# EAGLE design TMC2208 OTP (EAGLE 8.6.0)
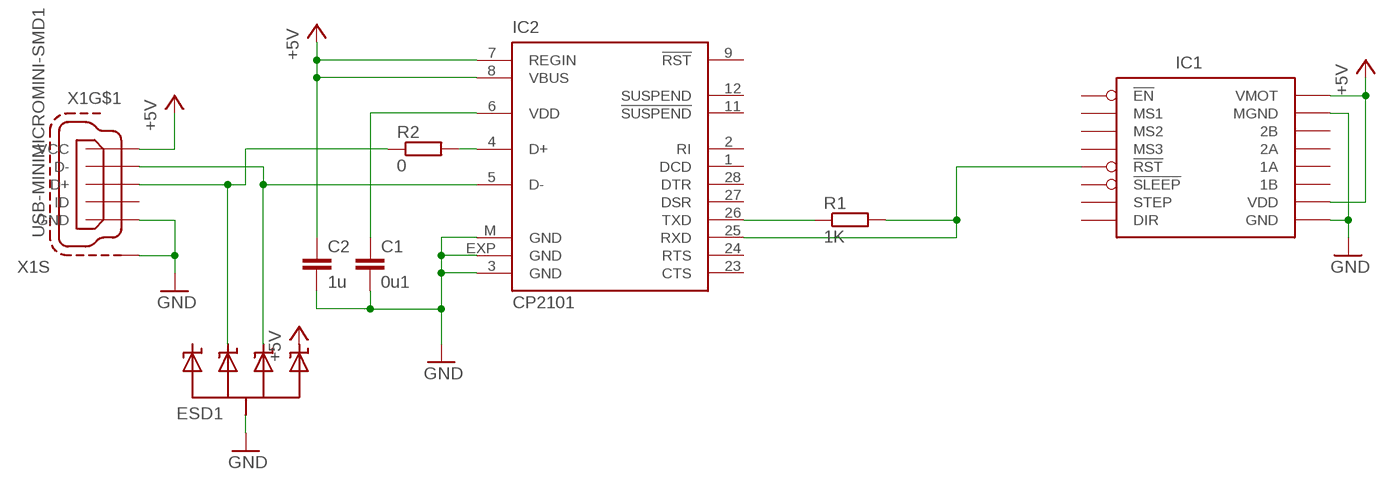
[diagram p0: schematic, sheet 1]

## Parts
C1  0u1  CAP_0805  [C0805]
C2  1u  CAP_0805  [C0805]
ESD1  ESDAXXSC5  [SOT23-5L]
IC1  STEP-DRV  [DRV-BRK]
IC2  CP2101  [MLP28]
R1  1K  R_0805  [R0805]
R2  0  R_0805  [R0805]
X1  USB-MINIMICROMINI-SMD1  [32005-201]

## Nets
+5V: C2.1 ESD1.5(C4) IC1.P$10(VDD) IC1.P$16(VMOT) IC2.7(REGIN) IC2.8(VBUS) X1.1(VCC)
GND: C1.2 C2.2 ESD1.2(A) IC1.P$9(GND) IC1.P$15(MGND) IC2.3(GND) IC2.EXP(GND) IC2.M(GND) X1.5(GND) X1.M1(S:S1) X1.M2(S:S1) X1.M3(S:S1) X1.M4(S:S1)
N$1: C1.1 IC2.6(VDD)
N$2: IC2.26(TXD) R1.1
N$3: IC1.P$5(!RST) IC2.25(RXD) R1.2
N$4: IC2.4(D+) R2.2
N$5: ESD1.4(C3) IC2.5(D-) X1.2(D-)
N$6: ESD1.3(C2) R2.1 X1.3(D+)
Unconnected: ESD1.1(C1) IC1.P$1(!EN) IC1.P$2(MS1) IC1.P$3(MS2) IC1.P$4(MS3) IC1.P$6(!SLEEP) IC1.P$7(STEP) IC1.P$8(DIR) IC1.P$11(1B) IC1.P$12(1A) IC1.P$13(2A) IC1.P$14(2B) IC2.1(DCD) IC2.2(RI) IC2.9(!RST) IC2.11(!SUSPEND) IC2.12(SUSPEND) IC2.23(CTS) IC2.24(RTS) IC2.27(DSR) IC2.28(DTR) X1.4(ID)

## Library data of the parts
C1 C2 = Namenlos:CAP_
ESD1 = Namenlos:ESDAXXSC5
IC1 = Namenlos:STEP-DRV
IC2 = Namenlos:CP210*: Single-Chip USB to UART Bridge Source: www.silabs.com .. CP2101.pdf / cp2102.pdf; MF: FARNELL; MPN: CP2102-GM; OC_FARNELL: 9282130; OC_NEWARK: 30K5635
R1 R2 = Namenlos:R_
X1 = Namenlos:USB-MINIMICRO: MINI USB-B Conector Source: www.cypressindustries.com; OC_FARNELL: unknown; OC_NEWARK: unknown

## Board
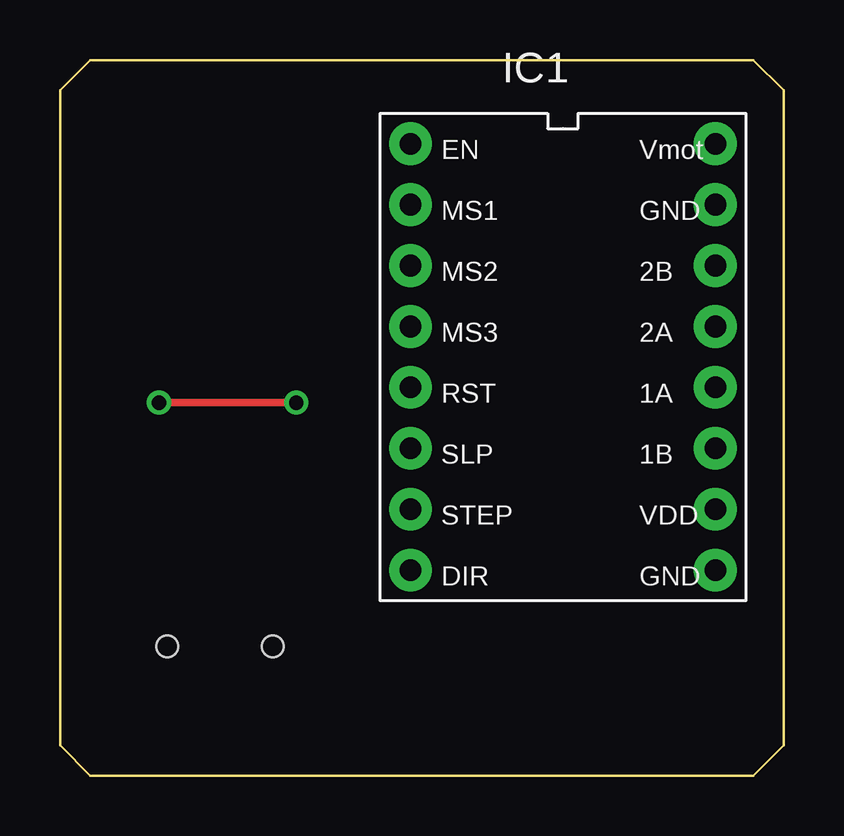
[diagram p1: board, top side]
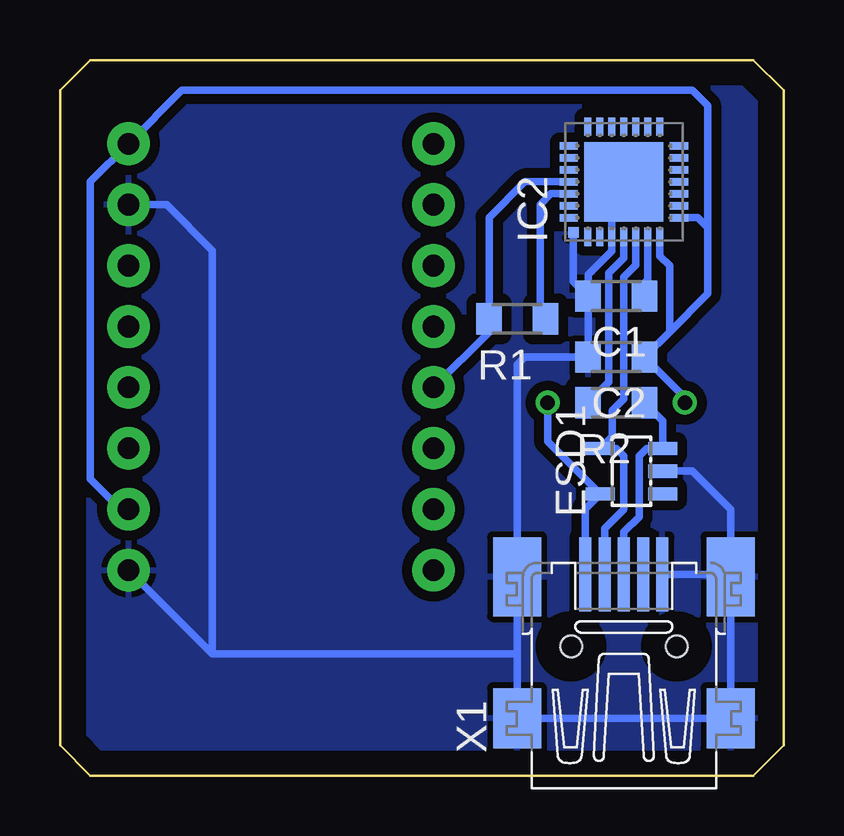
[diagram p2: board, bottom side, seen from below]

Size 30.16 x 29.84 mm. Coordinates in mm from the lower left corner, seen from the top.
Outline: 1.27,29.84 28.89,29.84 30.16,28.57 30.16,1.27 28.89,0 1.27,0 0,1.27 0,28.57 1.27,29.84
Copper layers (1*16): Top 0.035mm / dielectric 1.5mm / Bottom 0.035mm
Design rules "default": minimum track width 6mil, minimum drill 0.35mm, track to track 6mil, track to pad 6mil, pad to pad 6mil, via to via 6mil, smd to smd 6mil, copper to edge 40mil, drill to drill 6mil, minimum pad ring 10mil, minimum via ring 8mil, stop-mask expansion 4mil, vias tented up to drill 0mil, thermal gap 10mil

### Footprints (pad centres in the part's own frame; a part is rotated, then mirrored left to right if it is on the bottom)
C0805 = smd 1.05 x 1.3: 1 -1.175,0; 2 1.175,0
SOT23-5L = smd 0.55 x 1.2: 1 -0.95,-1.3; 2 0,-1.3; 3 0.95,-1.3; 4 0.95,1.3; 5 -0.95,1.3
DRV-BRK = drill 0.9 pad 1.778: P$1 -8.89,-6.35; P$2 -6.35,-6.35; P$3 -3.81,-6.35; P$4 -1.27,-6.35; P$5 1.27,-6.35; P$6 3.81,-6.35; P$7 6.35,-6.35; P$8 8.89,-6.35; P$9 8.89,6.35; P$10 6.35,6.35; P$11 3.81,6.35; P$12 1.27,6.35; P$13 -1.27,6.35; P$14 -3.81,6.35; P$15 -6.35,6.35; P$16 -8.89,6.35
MLP28 = smd 0.762 x 0.3: 1 -2.3,1.5; 2 -2.3,1; 3 -2.3,0.5; 4 -2.3,0; 5 -2.3,-0.5; 6 -2.3,-1; 7 -2.3,-1.5; 15 2.3,-1.5; 16 2.3,-1; 17 2.3,-0.5; 18 2.3,0; 19 2.3,0.5; 20 2.3,1; 21 2.3,1.5 | smd 0.3 x 0.762: 8 -1.5,-2.3; 9 -1,-2.3; 10 -0.5,-2.3; 11 0,-2.3; 12 0.5,-2.3; 13 1,-2.3; 14 1.5,-2.3; 22 1.5,2.3; 23 1,2.3; 24 0.5,2.3; 25 0,2.3; 26 -0.5,2.3; 27 -1,2.3; 28 -1.5,2.3 | smd 3.3 x 3.3: EXP 0,0 | smd 0.435 x 0.435: M -2.103,2.103
R0805 = smd 1.05 x 1.3: 1 -1.175,0; 2 1.175,0
32005-201 = smd 3.1 x 0.5: 1 3,1.6; 2 3,0.8; 3 3,0; 4 3,-0.8; 5 3,-1.6 | smd 2.5 x 2: M1 -3,-4.45; M2 -3,4.45 | smd 3.3 x 2: M3 2.9,4.45; M4 2.9,-4.45 | hole 0.9: 0,2.2; 0,-2.2

### Placement (x,y rotation side)
C1  6.98,20 180 bottom
C2  6.98,17.46 180 bottom
ESD1  6.35,12.7 90 bottom
IC1  20.96,17.46 270 top
IC2  6.67,24.77 90 bottom
R1  11.11,19.05 180 bottom
R2  6.98,15.56 180 bottom
X1  6.67,5.4 90 bottom

### Tracks (layer width: path | path; a pad name or v marks a point on that pad's centre or on a via)
+5V  (via drill 0.6)
  Top 0.305: v9.84,15.56 v4.13,15.56
  Bottom 0.305: X1.1 8.27,11.13 ESD1.5 9.84,13.94 v9.84,15.56 | 4.76,18.51 C2.1 4.13,15.78 v4.13,15.56 | IC2.7 5.17,21.68 4.76,21.27 4.76,18.51 | IC2.8 3.58,23.27 3.17,22.86 | 3.17,22.86 3.17,20.1 4.76,18.51 | IC1.P$10 27.62,11.11 28.89,12.38 28.89,24.77 IC1.P$16 25.08,28.57 3.81,28.57 3.17,27.94 3.17,22.86
GND
  Bottom 0.305: 11.12,5.08 X1.M3 11.12,17.14 10.79,17.46 C2.2 C1.2 | 11.12,5.08 X1.M2 X1.M1 X1.M4 | X1.5 2.32,8.4 X1.M4 | ESD1.2 3.81,12.7 2.22,11.11 X1.M4 | IC2.M 8.77,20.61 C1.2 | IC2.EXP 7.17,24.27 IC2.3 7.17,21.88 8.16,20.89 C1.2 | IC1.P$9 23.81,5.08 | 23.81,5.08 11.12,5.08 | IC1.P$15 25.72,23.81 23.81,21.91 23.81,5.08
  pour Bottom (isolate 0.406): 0,15.88 0,28.57 1.27,29.84 23.81,29.84 28.89,29.84 30.16,28.57 30.16,9.21 30.16,1.27 28.89,0 13.65,0 1.27,0 0,1.27 0,15.56
N$1
  Bottom 0.305: IC2.6 5.67,20.68 5.81,20.54 C1.1
N$2
  Bottom 0.305: IC2.26 9.71,24.27 10.16,23.81 10.16,19.27 R1.1
N$3
  Bottom 0.305: IC2.25 10.79,24.77 12.29,23.27 R1.2 12.29,18.51 IC1.P$5
N$4
  Bottom 0.305: IC2.4 6.67,21.59 7.3,20.95 7.3,16.41 R2.2
N$5
  Bottom 0.305: X1.2 7.47,10.31 6.67,11.11 6.67,13.33 6.98,13.65 6.99,13.65 ESD1.4 7.14,14.16 7.14,15.24 6.67,15.72 6.67,20.8 6.17,21.3 IC2.5
N$6
  Bottom 0.305: X1.3 6.67,10.16 6.03,10.79 6.03,13.33 5.71,13.65 ESD1.3 5.05,14.8 R2.1